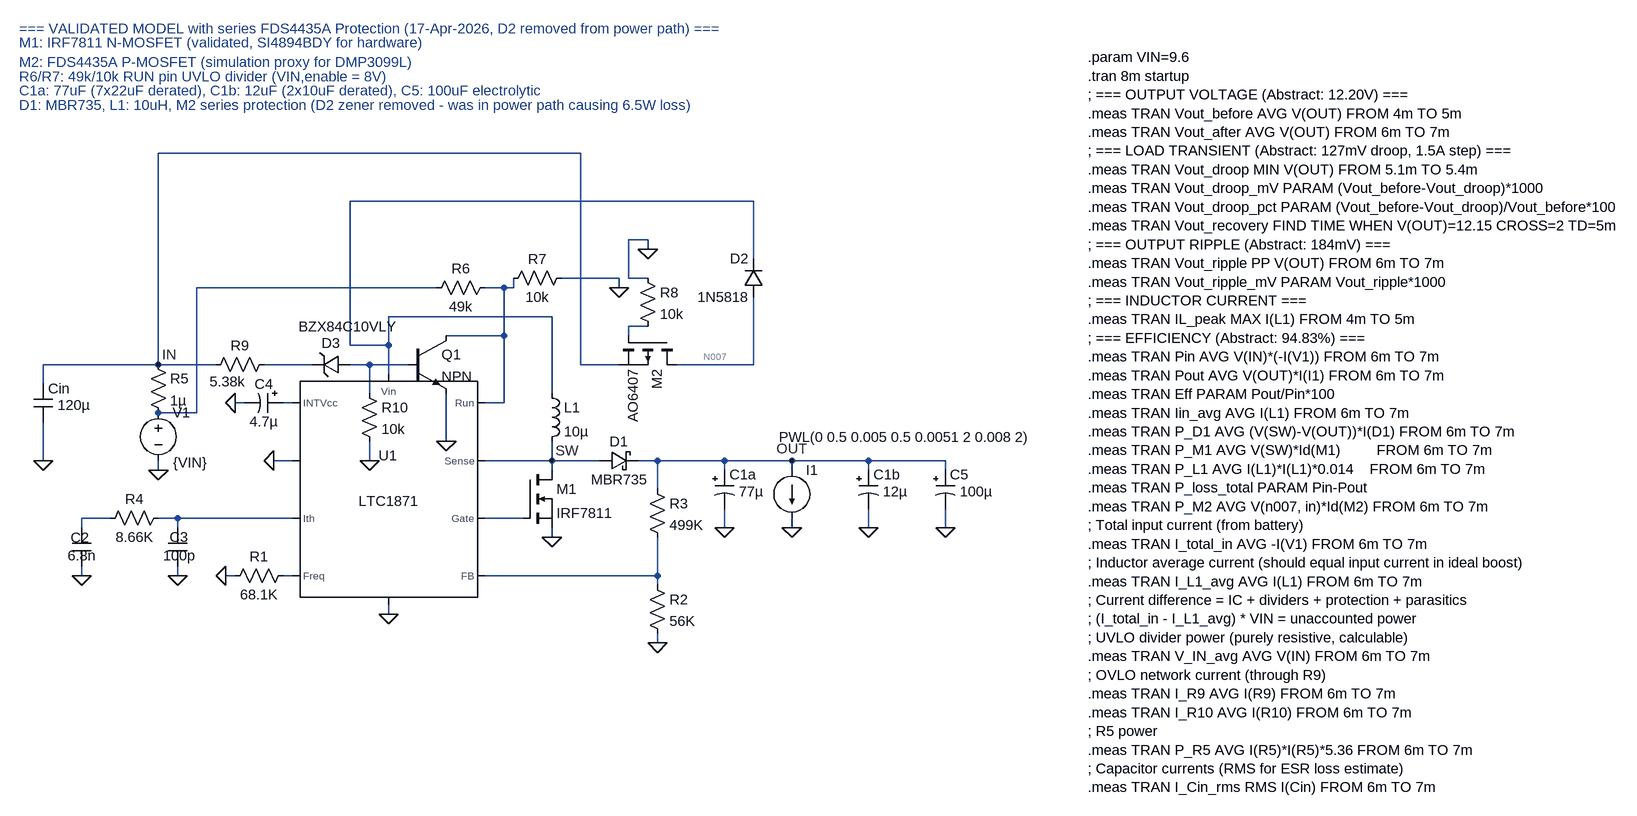
[diagram p0: schematic LTC1871_Validated_Final_Fixed_V2.asc]
LTC1871_Validated_Final_Fixed_V2.asc, the LTspice schematic file:
Version 4.1
SHEET 1 5664 2640
WIRE 1952 816 1248 816
WIRE 2240 896 1568 896
WIRE 2064 960 2032 960
WIRE 2064 976 2064 960
WIRE 2240 992 2240 896
WIRE 2016 1024 1920 1024
WIRE 2032 1024 2032 960
WIRE 2064 1024 2032 1024
WIRE 1712 1040 1312 1040
WIRE 1824 1040 1792 1040
WIRE 1840 1040 1840 1024
WIRE 1840 1040 1824 1040
WIRE 2016 1040 2016 1024
WIRE 1904 1088 1632 1088
WIRE 2064 1104 2032 1104
WIRE 1824 1120 1824 1040
WIRE 1824 1120 1728 1120
WIRE 2032 1120 2032 1104
WIRE 1568 1136 1568 896
WIRE 1632 1136 1632 1088
WIRE 1632 1136 1568 1136
WIRE 1248 1168 1248 816
WIRE 1248 1168 1056 1168
WIRE 1344 1168 1248 1168
WIRE 1504 1168 1424 1168
WIRE 1600 1168 1568 1168
WIRE 1664 1168 1600 1168
WIRE 1952 1168 1952 816
WIRE 2016 1168 1952 1168
WIRE 2240 1168 2240 1056
WIRE 2240 1168 2112 1168
WIRE 1632 1184 1632 1136
WIRE 1056 1200 1056 1168
WIRE 1600 1216 1600 1168
WIRE 1904 1216 1904 1088
WIRE 1392 1232 1376 1232
WIRE 1472 1232 1456 1232
WIRE 1824 1232 1824 1120
WIRE 1824 1232 1792 1232
WIRE 1312 1248 1312 1040
WIRE 1312 1248 1248 1248
WIRE 1728 1296 1728 1216
WIRE 1056 1328 1056 1264
WIRE 1472 1328 1440 1328
WIRE 1600 1328 1600 1296
WIRE 1904 1328 1904 1296
WIRE 1904 1328 1792 1328
WIRE 1984 1328 1904 1328
WIRE 2080 1328 2048 1328
WIRE 2192 1328 2080 1328
WIRE 2304 1328 2192 1328
WIRE 2432 1328 2304 1328
WIRE 2560 1328 2432 1328
WIRE 1248 1344 1248 1328
WIRE 1904 1344 1904 1328
WIRE 2192 1344 2192 1328
WIRE 2304 1344 2304 1328
WIRE 2432 1344 2432 1328
WIRE 2560 1344 2560 1328
WIRE 2080 1376 2080 1328
WIRE 1168 1424 1120 1424
WIRE 1280 1424 1248 1424
WIRE 1472 1424 1280 1424
WIRE 1856 1424 1792 1424
WIRE 1120 1440 1120 1424
WIRE 1280 1440 1280 1424
WIRE 2192 1440 2192 1408
WIRE 2304 1440 2304 1424
WIRE 2432 1440 2432 1408
WIRE 2560 1440 2560 1408
WIRE 1904 1456 1904 1440
WIRE 1120 1520 1120 1504
WIRE 1280 1520 1280 1504
WIRE 1376 1520 1360 1520
WIRE 1472 1520 1456 1520
WIRE 2080 1520 2080 1456
WIRE 2080 1520 1792 1520
WIRE 2080 1536 2080 1520
WIRE 1632 1584 1632 1568
WIRE 2080 1632 2080 1616
FLAG 1056 1328 0
FLAG 1904 1456 0
FLAG 1360 1520 0
FLAG 2080 1632 0
FLAG 1632 1584 0
FLAG 2192 1440 0
FLAG 1280 1520 0
FLAG 1120 1520 0
FLAG 2304 1440 0
FLAG 2432 1440 0
FLAG 1248 1344 0
FLAG 1440 1328 0
FLAG 1376 1232 0
FLAG 2304 1328 OUT
FLAG 1248 1168 IN
FLAG 2016 1040 0
FLAG 2064 976 0
FLAG 2560 1440 0
FLAG 1728 1296 0
FLAG 1600 1328 0
FLAG 1904 1328 SW
SYMBOL cap 1040 1200 R0
WINDOW 3 40 36 Left 2
SYMATTR Value 120µ
SYMATTR InstName Cin
SYMBOL RES 1472 1504 R90
WINDOW 0 0 56 VBottom 2
WINDOW 3 32 56 VTop 2
SYMATTR InstName R1
SYMATTR Value 68.1K
SYMBOL res 2064 1520 R0
SYMATTR InstName R2
SYMATTR Value 56K
SYMBOL res 2064 1360 R0
SYMATTR InstName R3
SYMATTR Value 499K
SYMBOL ind 1888 1200 R0
SYMATTR InstName L1
SYMATTR Value 10µ
SYMATTR SpiceLine Rser=14m
SYMBOL schottky 1984 1344 R270
WINDOW 0 32 32 VTop 2
WINDOW 3 0 32 VBottom 2
SYMATTR InstName D1
SYMATTR Value MBR735
SYMBOL polcap 2176 1344 R0
WINDOW 40 27 64 Left 2
WINDOW 3 40 36 Left 2
SYMATTR Value 77µ
SYMATTR InstName C1a
SYMBOL polcap 2416 1344 R0
WINDOW 40 27 64 Left 2
WINDOW 3 40 36 Left 2
SYMATTR Value 12µ
SYMATTR InstName C1b
SYMBOL res 1264 1408 R90
WINDOW 0 0 56 VBottom 2
WINDOW 3 32 56 VTop 2
SYMATTR InstName R4
SYMATTR Value 8.66K
SYMBOL cap 1104 1440 R0
WINDOW 0 -2 17 Left 2
WINDOW 3 -7 47 Left 2
SYMATTR InstName C2
SYMATTR Value 6.8n
SYMBOL cap 1264 1440 R0
WINDOW 0 3 16 Left 2
WINDOW 3 -8 47 Left 2
SYMATTR InstName C3
SYMATTR Value 100p
SYMBOL POWERPRODUCTS\\LTC1871 1632 1376 R0
WINDOW 0 -1 -56 Center 2
SYMATTR InstName U1
SYMBOL VOLTAGE 1248 1232 R0
WINDOW 123 0 0 Left 0
WINDOW 39 -11 -34 Left 0
WINDOW 3 25 100 Left 2
SYMATTR Value {VIN}
SYMATTR InstName V1
SYMBOL polcap 1456 1216 R90
WINDOW 0 0 32 VBottom 2
WINDOW 3 32 32 VTop 2
SYMATTR InstName C4
SYMATTR Value 4.7µ
SYMBOL current 2304 1344 R0
WINDOW 123 0 0 Left 0
WINDOW 39 0 0 Left 0
WINDOW 3 -21 -55 Left 2
SYMATTR Value PWL(0 0.5 0.005 0.5 0.0051 2 0.008 2)
SYMATTR InstName I1
SYMBOL res 1232 1152 R0
SYMATTR InstName R5
SYMATTR Value 1µ
SYMBOL nmos 1856 1344 R0
SYMATTR InstName M1
SYMATTR Value IRF7811
SYMBOL res 1808 1024 R90
WINDOW 0 0 56 VBottom 2
WINDOW 3 32 56 VTop 2
SYMATTR InstName R6
SYMATTR Value 49k
SYMBOL res 1936 1008 R90
WINDOW 0 0 56 VBottom 2
WINDOW 3 32 56 VTop 2
SYMATTR InstName R7
SYMATTR Value 10k
SYMBOL pmos 2112 1120 R90
SYMATTR InstName M2
SYMATTR Value AO6407
SYMBOL res 2048 1008 R0
SYMATTR InstName R8
SYMATTR Value 10k
SYMBOL polcap 2544 1344 R0
WINDOW 40 27 64 Left 2
WINDOW 3 40 36 Left 2
SYMATTR Value 100µ
SYMATTR SpiceLine Rser=0.1
SYMATTR InstName C5
SYMBOL diode 2256 1056 R180
WINDOW 0 24 64 Left 2
WINDOW 3 24 0 Left 2
SYMATTR InstName D2
SYMATTR Value 1N5818
SYMBOL zener 1568 1152 R90
WINDOW 0 -4 32 VBottom 2
WINDOW 3 -63 5 VTop 2
SYMATTR InstName D3
SYMATTR Value BZX84C10VLY
SYMBOL npn 1664 1120 R0
SYMATTR InstName Q1
SYMBOL res 1440 1152 R90
WINDOW 0 0 56 VBottom 2
WINDOW 3 29 77 VTop 2
SYMATTR InstName R9
SYMATTR Value 5.38k
SYMBOL res 1584 1200 R0
SYMATTR InstName R10
SYMATTR Value 10k
TEXT 3424 656 Left 2 !.param VIN=9.6\n.tran 8m startup\n; === OUTPUT VOLTAGE (Abstract: 12.20V) ===\n.meas TRAN Vout_before AVG V(OUT) FROM 4m TO 5m\n.meas TRAN Vout_after AVG V(OUT) FROM 6m TO 7m\n; === LOAD TRANSIENT (Abstract: 127mV droop, 1.5A step) ===\n.meas TRAN Vout_droop MIN V(OUT) FROM 5.1m TO 5.4m\n.meas TRAN Vout_droop_mV PARAM (Vout_before-Vout_droop)*1000\n.meas TRAN Vout_droop_pct PARAM (Vout_before-Vout_droop)/Vout_before*100\n.meas TRAN Vout_recovery FIND TIME WHEN V(OUT)=12.15 CROSS=2 TD=5m\n; === OUTPUT RIPPLE (Abstract: 184mV) ===\n.meas TRAN Vout_ripple PP V(OUT) FROM 6m TO 7m\n.meas TRAN Vout_ripple_mV PARAM Vout_ripple*1000\n; === INDUCTOR CURRENT ===\n.meas TRAN IL_peak MAX I(L1) FROM 4m TO 5m\n; === EFFICIENCY (Abstract: 94.83%) ===\n.meas TRAN Pin AVG V(IN)*(-I(V1)) FROM 6m TO 7m\n.meas TRAN Pout AVG V(OUT)*I(I1) FROM 6m TO 7m\n.meas TRAN Eff PARAM Pout/Pin*100\n.meas TRAN Iin_avg AVG I(L1) FROM 6m TO 7m\n.meas TRAN P_D1 AVG (V(SW)-V(OUT))*I(D1) FROM 6m TO 7m\n.meas TRAN P_M1 AVG V(SW)*Id(M1)         FROM 6m TO 7m\n.meas TRAN P_L1 AVG I(L1)*I(L1)*0.014    FROM 6m TO 7m\n.meas TRAN P_loss_total PARAM Pin-Pout\n.meas TRAN P_M2 AVG V(n007, in)*Id(M2) FROM 6m TO 7m\n; Total input current (from battery)\n.meas TRAN I_total_in AVG -I(V1) FROM 6m TO 7m\n; Inductor average current (should equal input current in ideal boost)\n.meas TRAN I_L1_avg AVG I(L1) FROM 6m TO 7m\n; Current difference = IC + dividers + protection + parasitics\n; (I_total_in - I_L1_avg) * VIN = unaccounted power\n; UVLO divider power (purely resistive, calculable)\n.meas TRAN V_IN_avg AVG V(IN) FROM 6m TO 7m\n; OVLO network current (through R9)\n.meas TRAN I_R9 AVG I(R9) FROM 6m TO 7m\n.meas TRAN I_R10 AVG I(R10) FROM 6m TO 7m\n; R5 power\n.meas TRAN P_R5 AVG I(R5)*I(R5)*5.36 FROM 6m TO 7m\n; Capacitor currents (RMS for ESR loss estimate)\n.meas TRAN I_Cin_rms RMS I(Cin) FROM 6m TO 7m
TEXT 1016 608 Left 2 ;=== VALIDATED MODEL with series FDS4435A Protection (17-Apr-2026, D2 removed from power path) ===
TEXT 1016 632 Left 2 ;M1: IRF7811 N-MOSFET (validated, SI4894BDY for hardware)
TEXT 1016 664 Left 2 ;M2: FDS4435A P-MOSFET (simulation proxy for DMP3099L)
TEXT 1016 688 Left 2 ;R6/R7: 49k/10k RUN pin UVLO divider (VIN,enable = 8V)
TEXT 1016 712 Left 2 ;C1a: 77uF (7x22uF derated), C1b: 12uF (2x10uF derated), C5: 100uF electrolytic
TEXT 1016 736 Left 2 ;D1: MBR735, L1: 10uH, M2 series protection (D2 zener removed - was in power path causing 6.5W loss)

The netlist it stands for:
* LTC1871_Validated_Final_Fixed_V2.asc
Cin IN 0 120µ
R1 N012 0 68.1K
R2 N013 0 56K
R3 OUT N013 499K
L1 N001 SW 10µ Rser=14m
D1 SW OUT MBR735
C1a OUT 0 77µ
C1b OUT 0 12µ
R4 N010 N009 8.66K
C2 N009 0 6.8n
C3 N010 0 100p
X§U1 N003 N010 N013 N012 0 0 N011 N008 N001 SW LTC1871  ; pins Run Ith FB Freq ? ? Gate INTVcc Vin Sense
V1 N002 0 {VIN}
C4 N008 0 4.7µ
I1 OUT 0 PWL(0 0.5 0.005 0.5 0.0051 2 0.008 2)
R5 IN N002 1µ
M1 SW N011 0 0 IRF7811
R6 N003 N002 49k
R7 0 N003 10k
M2 N007 N004 IN IN AO6407
R8 0 N004 10k
C5 OUT 0 100µ Rser=0.1
D2 N007 N001 1N5818
D3 N006 N005 BZX84C10VLY
Q1 N003 N006 0 0 NPN
R9 N005 IN 5.38k
R10 N006 0 10k
.model D D
.lib standard.dio
.model NPN NPN
.model PNP PNP
.lib standard.bjt
.model NMOS NMOS
.model PMOS PMOS
.lib standard.mos
.param VIN=9.6
.tran 8m startup
; === OUTPUT VOLTAGE (Abstract: 12.20V) ===
.meas TRAN Vout_before AVG V(OUT) FROM 4m TO 5m
.meas TRAN Vout_after AVG V(OUT) FROM 6m TO 7m
; === LOAD TRANSIENT (Abstract: 127mV droop, 1.5A step) ===
.meas TRAN Vout_droop MIN V(OUT) FROM 5.1m TO 5.4m
.meas TRAN Vout_droop_mV PARAM (Vout_before-Vout_droop)*1000
.meas TRAN Vout_droop_pct PARAM (Vout_before-Vout_droop)/Vout_before*100
.meas TRAN Vout_recovery FIND TIME WHEN V(OUT)=12.15 CROSS=2 TD=5m
; === OUTPUT RIPPLE (Abstract: 184mV) ===
.meas TRAN Vout_ripple PP V(OUT) FROM 6m TO 7m
.meas TRAN Vout_ripple_mV PARAM Vout_ripple*1000
; === INDUCTOR CURRENT ===
.meas TRAN IL_peak MAX I(L1) FROM 4m TO 5m
; === EFFICIENCY (Abstract: 94.83%) ===
.meas TRAN Pin AVG V(IN)*(-I(V1)) FROM 6m TO 7m
.meas TRAN Pout AVG V(OUT)*I(I1) FROM 6m TO 7m
.meas TRAN Eff PARAM Pout/Pin*100
.meas TRAN Iin_avg AVG I(L1) FROM 6m TO 7m
.meas TRAN P_D1 AVG (V(SW)-V(OUT))*I(D1) FROM 6m TO 7m
.meas TRAN P_M1 AVG V(SW)*Id(M1)         FROM 6m TO 7m
.meas TRAN P_L1 AVG I(L1)*I(L1)*0.014    FROM 6m TO 7m
.meas TRAN P_loss_total PARAM Pin-Pout
.meas TRAN P_M2 AVG V(n007, in)*Id(M2) FROM 6m TO 7m
; Total input current (from battery)
.meas TRAN I_total_in AVG -I(V1) FROM 6m TO 7m
; Inductor average current (should equal input current in ideal boost)
.meas TRAN I_L1_avg AVG I(L1) FROM 6m TO 7m
; Current difference = IC + dividers + protection + parasitics
; (I_total_in - I_L1_avg) * VIN = unaccounted power
; UVLO divider power (purely resistive, calculable)
.meas TRAN V_IN_avg AVG V(IN) FROM 6m TO 7m
; OVLO network current (through R9)
.meas TRAN I_R9 AVG I(R9) FROM 6m TO 7m
.meas TRAN I_R10 AVG I(R10) FROM 6m TO 7m
; R5 power
.meas TRAN P_R5 AVG I(R5)*I(R5)*5.36 FROM 6m TO 7m
; Capacitor currents (RMS for ESR loss estimate)
.meas TRAN I_Cin_rms RMS I(Cin) FROM 6m TO 7m
* === VALIDATED MODEL with series FDS4435A Protection (17-Apr-2026, D2 removed from power path) ===
* M1: IRF7811 N-MOSFET (validated, SI4894BDY for hardware)
* M2: FDS4435A P-MOSFET (simulation proxy for DMP3099L)
* R6/R7: 49k/10k RUN pin UVLO divider (VIN,enable = 8V)
* C1a: 77uF (7x22uF derated), C1b: 12uF (2x10uF derated), C5: 100uF electrolytic
* D1: MBR735, L1: 10uH, M2 series protection (D2 zener removed - was in power path causing 6.5W loss)
.lib LTC1871.sub
.backanno
.end